# EAGLE design Whastbee-display3 (EAGLE 7.6.0)
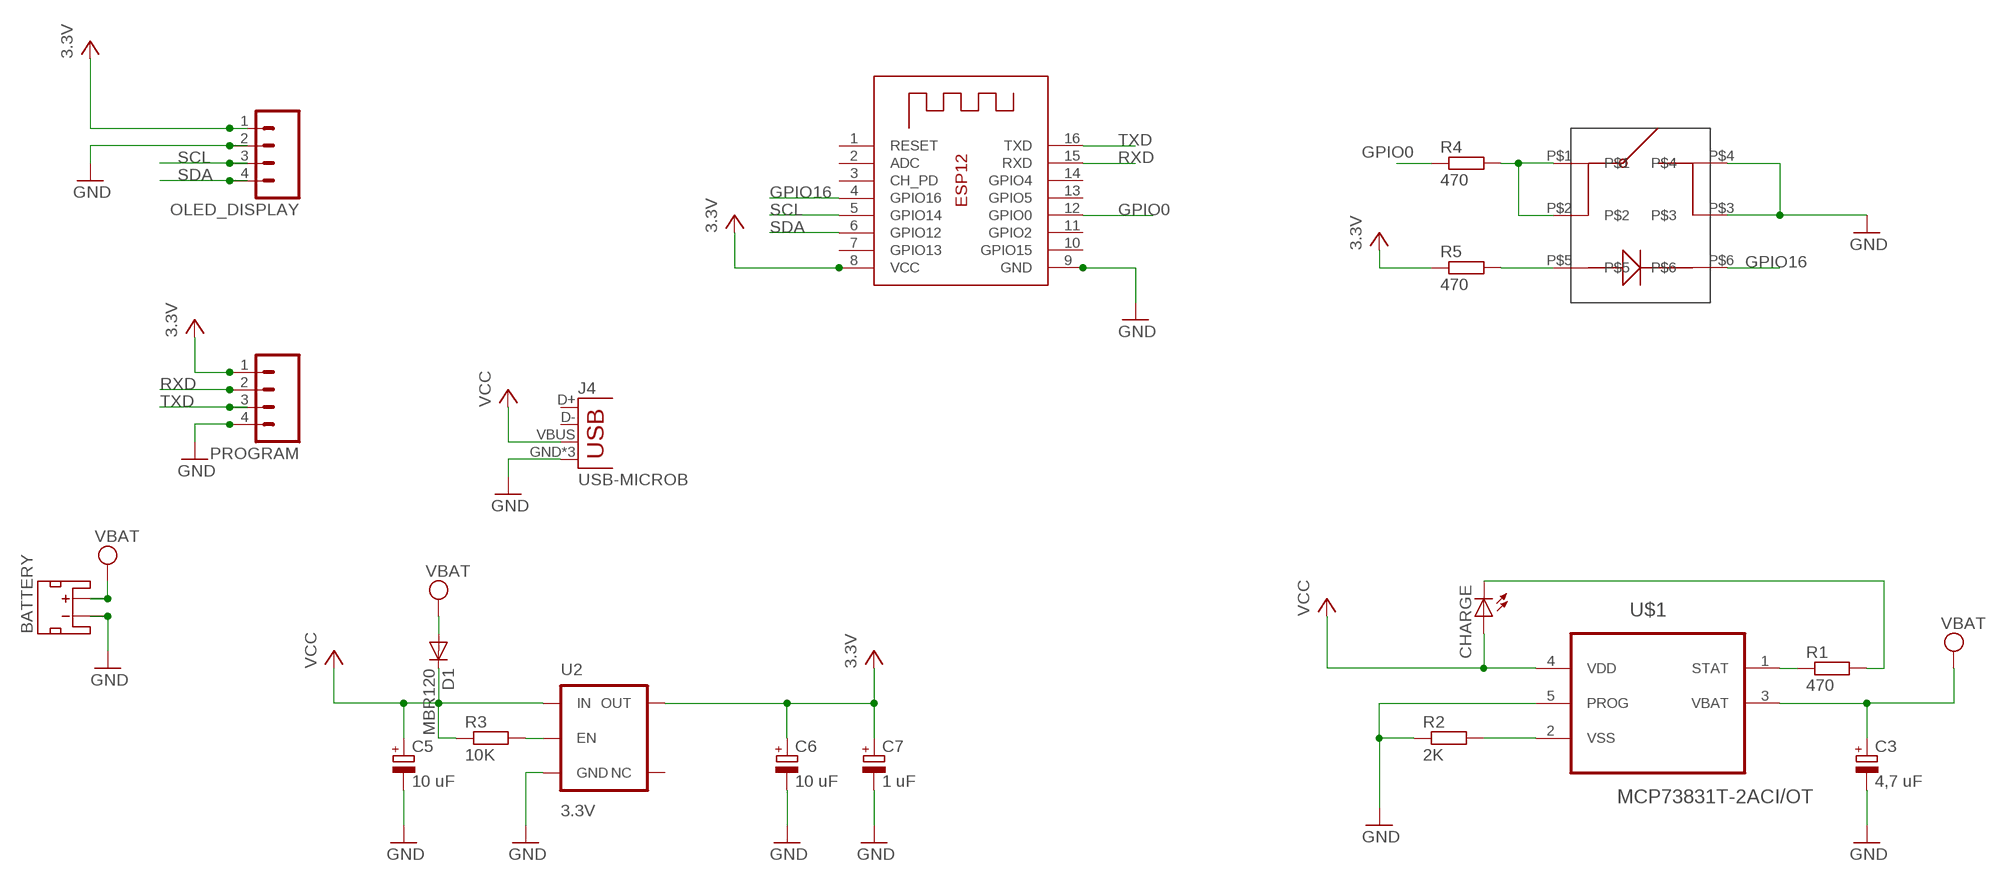
[diagram p0: schematic, sheet 1]

## Parts
BATTERY  JST_2MM_MALE  [JST-2-SMD]
C3  4,7 uF  CPOL-EUT/3528-12R  [T/3528-12R]
C5  10 uF  CPOL-EUT/3528-12R  [T/3528-12R]
C6  10 uF  CPOL-EUT/3528-12R  [T/3528-12R]
C7  1 uF  CPOL-EUT/3528-12R  [T/3528-12R]
CHARGE  LEDCHIPLED_0805  [CHIPLED_0805]
D1  MBR120  CGRM4001-G  [SOD-123_MINI-SMA]
ESP8266-12  ESP-12  [ESP-12]
J4  USB-MICROB  [USB-MICROB]
OLED_DISPLAY  M04PTH  [1X04]
PROGRAM  M04LOCK  [1X04_LOCK]
R1  470  R  [R0805]
R2  2K  R  [R0805]
R3  10K  R  [R0805]
R4  470  R  [R0805]
R5  470  R  [R0805]
U2  3.3V  V_REG_AP2112K-3.3V  [SOT23-5]
U$1  MCP73831T-2ACI/OT  [SOT95P280X145-5N]
U$2  SWITCH-LED_AMIDATA  [LED]

## Nets
3.3V: C6.+ C7.+ ESP8266-12.8(VCC) OLED_DISPLAY.1 PROGRAM.1 R5.1 U2.5(OUT)
GND: BATTERY.1(-) C3.- C5.- C6.- C7.- ESP8266-12.9(GND) J4.GND J4.MT1(GND) J4.MT2(GND) OLED_DISPLAY.2 PROGRAM.4 R2.1 U2.2(GND) U$1.5(PROG) U$2.P$3 U$2.P$4
GPIO0: ESP8266-12.12(GPIO0) R4.1
GPIO16: ESP8266-12.4(GPIO16) U$2.P$6
N$2: R5.2 U$2.P$5
N$4: R2.2 U$1.2(VSS)
N$7: R1.1 U$1.1(STAT)
N$8: CHARGE.C R1.2
N$9: R3.2 U2.3(EN)
PS1: R4.2 U$2.P$1 U$2.P$2
RXD: ESP8266-12.15(RXD) PROGRAM.2
SCL: ESP8266-12.5(GPIO14) OLED_DISPLAY.3
SDA: ESP8266-12.6(GPIO12) OLED_DISPLAY.4
TXD: ESP8266-12.16(TXD) PROGRAM.3
VBAT: BATTERY.2(+) C3.+ D1.A U$1.3(VBAT)
VCC: C5.+ CHARGE.A D1.C J4.VBUS R3.1 U2.1(IN) U$1.4(VDD)
Unconnected: BATTERY.NC1(PAD1) BATTERY.NC2(PAD2) ESP8266-12.1(RESET) ESP8266-12.2(ADC) ESP8266-12.3(CH_PD) ESP8266-12.7(GPIO13) ESP8266-12.10(GPIO15) ESP8266-12.11(GPIO2) ESP8266-12.13(GPIO5) ESP8266-12.14(GPIO4) J4.D+ J4.D- U2.4(NC)

## Library data of the parts
BATTERY = SparkFun-Connectors:JST_2MM_MALE: Mates to single-cell LiPo batteries. CONN-11443 Now with smashable polarity marks!; BTM_NEG: -; BTM_POS: +; PROD_ID: CONN-11443; TOP_NEG: -; TOP_POS: +
C3 C5-C7 = resistor:CPOL-EU: POLARIZED CAPACITOR, European symbol
CHARGE = adafruit:LED: LED OSRAM: - CHIPLED LG R971, LG N971, LY N971, LG Q971, LY Q971, LO R971, LY R971 LH N974, LH R974 LS Q976, LO Q976, LY Q976 LO Q996 - Hyper CHIPLED LW Q18S LB Q993, LB Q99A, LB R99A - SideLED LS A670, LO A670, LY A670, LG A670, LP A670 LB A673, LV A673, LT A673, LW A673 LH A674 LY A675 LS A676, LA A676, LO A676, LY A676, LW A676 LS A679, LY A679, LG A679 - Hyper Micro SIDELED® LS Y876, LA Y876, LO Y876, LY Y876 LT Y87S - SmartLED LW L88C, LW L88S LB L89C, LB L89S, LG L890 LS L89K, LO L89K, LY L89K LS L896, LA L896, LO L896, LY L896 - TOPLED LS T670, LO T670, LY T670, LG T670, LP T670 LSG T670, LSP T670, LSY T670, LOP T670, LYG T670 LG T671, LOG T671, LSG T671 LB T673, LV T673, LT T673, LW T673 LH T674 LS T676, LA T676, LO T676, LY T676, LB T676, LH T676, LSB T676, LW T676 LB T67C, LV T67C, LT T67C, LS T67K, LO T67K, LY T67K, LW E67C LS E67B, LA E67B, LO E67B, LY E67B, LB E67C, LV E67C, LT E67C LW T67C LS T679, LY T679, LG T679 LS T770, LO T770, LY T770, LG T770, LP T770 LB T773, LV T773, LT T773, LW T773 LH T774 LS E675, LA E675, LY E675, LS T675 LS T776, LA T776, LO T776, LY T776, LB T776 LHGB T686 LT T68C, LB T68C - Hyper Mini TOPLED® LB M676 - Mini TOPLED Santana® LG M470 LS M47K, LO M47K, LY M47K Source: http://www.osram.convergy.de/
D1 = diode:CGRM400*-G: Molded plasitc,JEDEC SOD-123/Mini SMA Source: Comchip CGRM4001-G.pdf
ESP8266-12 = adafruit:ESP-12
J4 = SparkFun-Connectors:USB: USB Connectors USB-B-PTH is fully proven SKU : PRT-00139/CONN-08278 USB-miniB is fully proven SKU : PRT-00587 USB-A-PCB is untested. USB-A-H is throughly reviewed, but untested. Spark Fun Electronics SKU : PRT-00437 USB-B-SMT is throughly reviewed, but untested. Needs silkscreen touching up. USB-A-S has not been used/tested USB-MB-H has not been used/tested USB-MICROB has been used. CONN-09505; PROD_ID: CONN-09505
OLED_DISPLAY PROGRAM = SparkFun-Connectors:M04: Header 4 Standard 4-pin 0.1" header. Use with straight break away headers (SKU : PRT-00116), right angle break away headers (PRT-00553), swiss pins (PRT-00743), machine pins (PRT-00117), and female headers (PRT-00115). Molex polarized connector foot print use with SKU : PRT-08231 with associated crimp pins and housings. 1MM SMD Version SKU: PRT-10208; PROD_ID: CONN-09696
R1-R5 = eagle-ltspice:R: RESISTOR, European symbol; SPICEMODEL: NONE; SPICEPREFIX: R
U2 = SparkFun-PowerIC:V_REG_AP2112: AP2112 - 600mA CMOS LDO Regulator w/ Enable The AP2112 is CMOS process low dropout linear regulator with enable function, the regulator delivers a guaranteed 600mA (min.) continuous load current. Features Output Voltage Accuracy: ±1.5% Output Current: 600mA (Min.) Foldback Short Current Protection: 50mA Enable Function to Turn ON/OFF VOUT Low Dropout Voltage (3.3V): 250mV (Typ.) @IOUT=600mA Excellent Load Regulation: 0.2%/A (Typ.) Excellent Line Regulation: 0.02%/V (Typ.) Low Quiescent Current: 55μA (Typ.) Low Standby Current: 0.01μA (Typ.) Low Output Noise: 50μVRMS PSRR: 100Hz -65dB, 1kHz -65dB OTSD Protection Stable with 1.0μF Flexible Cap: Ceramic, Tantalum and Aluminum Electrolytic Operation Temperature Range: -40°C to 85°C ESD: MM 400V, HBM 4000V; PROD_ID: VREG-12457
U$1 = MCP73831T-2ACI_OT:MCP73831T-2ACI/OT: Charge Management Controller
U$2 = bmotes:SWITCH-LED_AMIDATA

## Board
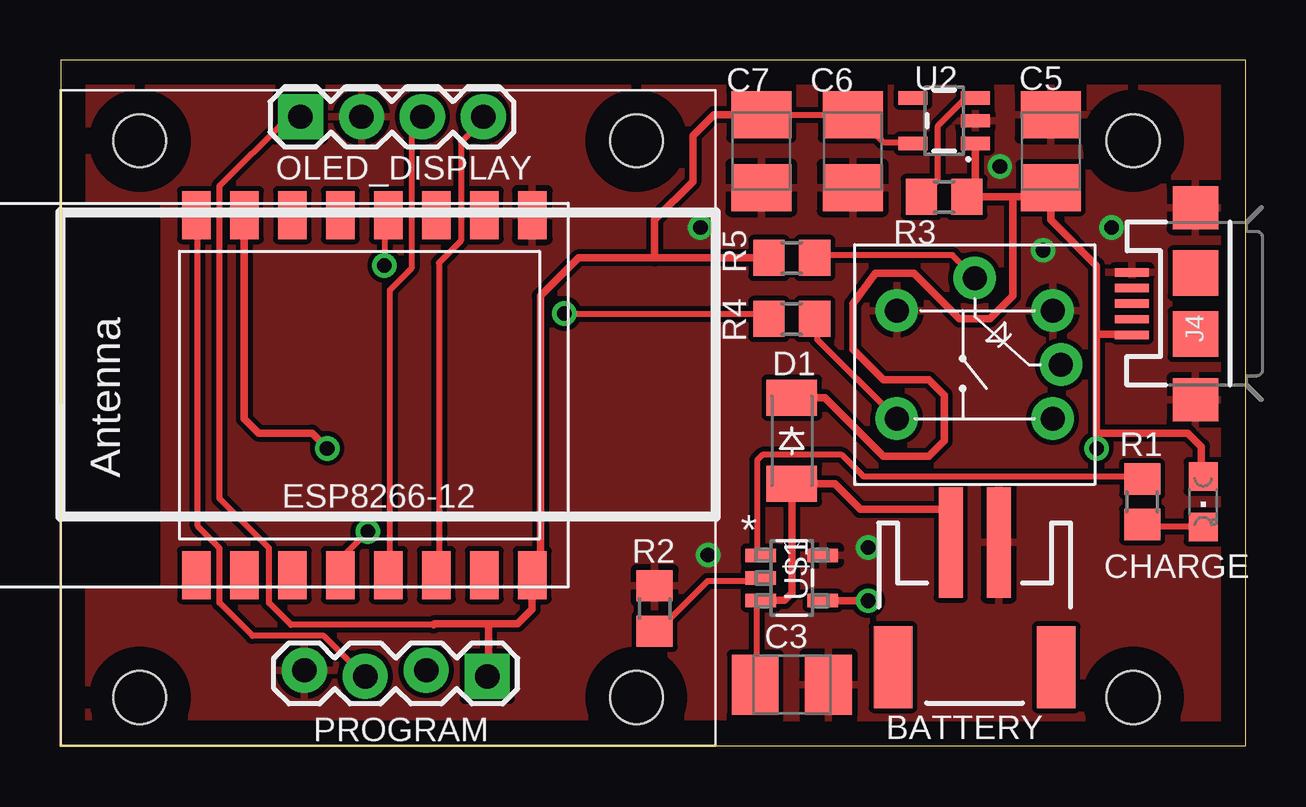
[diagram p1: board, top side]
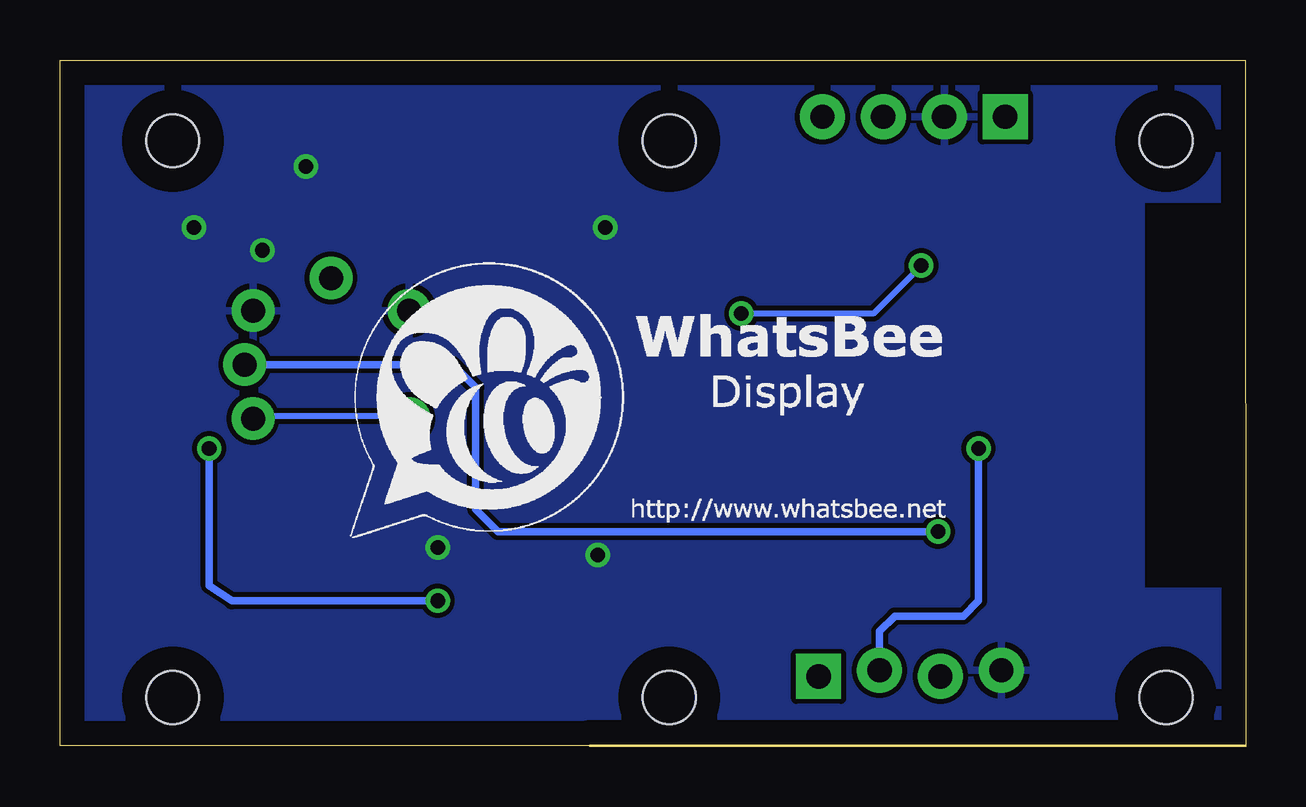
[diagram p2: board, bottom side, seen from below]

Size 49.43 x 28.62 mm. Coordinates in mm from the lower left corner, seen from the top.
Outline: 0,0 0.03,28.62 49.43,28.62 49.43,0.06 27.33,0.06 0.03,0.06
Copper layers (1*16): Top 0.035mm / dielectric 1.5mm / Bottom 0.035mm
Design rules "default": minimum track width 10mil, minimum drill 24mil, track to track 8mil, track to pad 8mil, pad to pad 8mil, via to via 8mil, smd to smd 8mil, copper to edge 40mil, drill to drill 8mil, minimum pad ring 10mil, minimum via ring 8mil, stop-mask expansion 4mil, vias tented up to drill 0mil, thermal gap 10mil
Holes 2.2 mm at 3.33,2.06 24.03,2.06 3.33,25.26 24.03,25.26 44.73,25.26 44.73,2.06

### Footprints (pad centres in the part's own frame; a part is rotated, then mirrored left to right if it is on the bottom)
JST-2-SMD = smd 1 x 4.6: 1 -1,-3.7; 2 1,-3.7 | smd 1.6 x 3.4: NC1 -3.4,1.5; NC2 3.4,1.5
T/3528-12R = smd 1.95 x 2.5: + 1.525,0; - -1.525,0
CHIPLED_0805 = smd 1.2 x 1.2: A 0,-1.05; C 0,1.05
SOD-123_MINI-SMA = smd 1.5 x 2.1: A 1.8,0; C -1.8,0
ESP-12 = smd 2 x 1.2: 1 -7.5,4.5; 2 -7.5,2.5; 3 -7.5,0.5; 4 -7.5,-1.5; 5 -7.5,-3.5; 6 -7.5,-5.5; 7 -7.5,-7.5; 8 -7.5,-9.5; 9 7.5,-9.5; 10 7.5,-7.5; 11 7.5,-5.5; 12 7.5,-3.5; 13 7.5,-1.5; 14 7.5,0.5; 15 7.5,2.5; 16 7.5,4.5
USB-MICROB = smd 0.35 x 1.4: D+ 0,2.65; D- -0.65,2.65; GND 1.3,2.65; ID 0.65,2.65; VBUS -1.3,2.65 | smd 1.8 x 1.9: MT1 -4,0; MT2 4,0 | smd 1.9 x 1.9: P$1 -1.27,0; P$2 1.27,0
1X04 = drill 1.016 pad 1.88 square: 1 0,0 | drill 1.016 pad 1.88: 2 2.54,0; 3 5.08,0; 4 7.62,0
1X04_LOCK = drill 1.016 pad 1.88 square: 1 0,0.127 | drill 1.016 pad 1.88: 2 2.54,-0.127; 3 5.08,0.127; 4 7.62,-0.127
R0805 = smd 1.3 x 1.5: 1 -0.95,0; 2 0.95,0
SOT23-5 = smd 0.55 x 1.2: 1 -0.95,-1.3; 2 0,-1.3; 3 0.95,-1.3; 4 0.95,1.3; 5 -0.95,1.3
SOT95P280X145-5N = smd 1.27 x 0.559: 1 -1.295,0.94; 2 -1.295,0; 3 -1.295,-0.94; 4 1.295,-0.94; 5 1.295,0.94
LED = drill 1 pad 1.778: P$1 -3.25,-2.25; P$2 3.25,-2.25; P$3 3.25,2.25; P$4 -3.25,2.25; P$5 0,3.6; P$6 3.6,0

### Placement (x,y rotation side)
BATTERY  38.13,4.82 180 top
C3  30.51,2.6 180 top
C5  41.3,24.82 270 top
C6  33.05,24.82 90 top
C7  29.24,24.82 90 top
CHARGE  47.65,10.22 180 top
D1  30.51,12.76 270 top
ESP8266-12  10.19,14.66 90 top
J4  47.33,18.47 90 top
OLED_DISPLAY  10.03,26.26 0 top
PROGRAM  17.81,3.07 180 top
R1  45.11,10.22 270 top
R2  24.79,5.77 270 top
R3  36.86,22.92 180 top
R4  30.51,17.84 0 top
R5  30.51,20.38 0 top
U2  36.86,26.09 90 top
U$1  30.51,7.04 0 top
U$2  38.13,15.93 0 top

### Tracks (layer width: path | path; a pad name or v marks a point on that pad's centre or on a via)
3.3V
  Top 0.254: U2.5 35.46,25.2 34.32,25.2 33.17,26.34 C6.+ 32.94,26.34 29.29,26.34 C7.+ 29.06,26.34 | 29.51,20.4 R5.1 29.51,20.17 | 19.69,7.14 ESP8266-12.8 | 17.86,3.03 PROGRAM.1 17.63,3.03 | 15.57,5.08 9.63,5.08 8.71,6 8.71,8.29 6.65,10.34 6.65,23.37 9.4,26.12 9.86,26.12 OLED_DISPLAY.1
  Top 0.305: R5.1 24.79,20.38 | 24.79,20.38 21.62,20.38 20.03,18.79 20.03,7.5 ESP8266-12.8 | 19.69,7.14 19.69,5.75 19.08,5.14 17.81,5.14 | 17.81,5.14 15.62,5.14 15.57,5.08 | 17.86,3.03 17.86,5.08 17.81,5.14 | 24.79,20.38 24.79,21.96 26.38,23.55 26.38,25.46 27.27,26.34 29.06,26.34
  Bottom 0.254: 17.86,3.03 PROGRAM.1
GND  (via drill 0.61)
  Top 0.254: 29.29,23.37 C7.- | 32.94,23.37 C6.-
  Top 0.305: U2.2 38.44,26.09 | 39.08,8.57 BATTERY.1
  Bottom 0.254: 34.77,18.11 U$2.P$4
  other vias: 40.98,20.69 43.84,21.65 26.7,21.65 33.68,8.31 27.01,7.99 39.18,24.19
  pour Top: 0.34,28.63 49.56,28.63 49.56,0.06 0.34,0.06
  pour Bottom: 0.03,28.63 49.24,28.63 49.24,0.06 0.03,0.06
GPIO0  (via drill 0.61)
  Top 0.254: v21.03,18.06 29.53,18.06 R4.1 | v13.53,20.06 13.53,22.06 ESP8266-12.12
  Bottom 0.254: v21.03,18.06 15.53,18.06 v13.53,20.06
GPIO16  (via drill 0.61)
  Top 0.254: v12.83,8.97 11.91,8.06 11.91,7.37 ESP8266-12.4
  Bottom 0.305: v12.83,8.97 31.17,8.97 32.09,9.9 32.09,14.98 33.05,15.93 U$2.P$6
N$2
  Top 0.254: R5.2 31.25,20.49 37.2,20.49 37.97,19.72 U$2.P$5
N$4
  Top 0.254: U$1.2 29.06,6.91 27,6.91 24.94,4.86 R2.2
N$7
  Top 0.254: U$1.1 29.06,8.06 29.06,11.94 29.29,12.17 32.59,12.17 33.5,11.26 45.06,11.26 R1.1
N$8
  Top 0.254: CHARGE.C 47.57,9.2 45.29,9.2 R1.2
N$9
  Top 0.254: U2.3 37.97,27.03 37.74,27.03 36.6,25.89 36.6,23.6 R3.2
PS1
  Top 0.254: R4.2 31.57,17.66 31.57,16.97 34.77,13.77 U$2.P$1
  Bottom 0.254: U$2.P$2 41.17,13.77 35,13.77 U$2.P$1
RXD  (via drill 0.61)
  Top 0.305: ESP8266-12.15 7.69,13.67 8.28,13.07 10.5,13.07 v11.14,12.44
  Bottom 0.305: v11.14,12.44 11.14,6.09 11.77,5.45 14.63,5.45 15.27,4.82 PROGRAM.2
SCL
  Top 0.254: ESP8266-12.5 13.74,7.37 13.74,19.03 14.66,19.94 14.66,25.89 14.88,26.12 OLED_DISPLAY.3
SDA
  Top 0.254: ESP8266-12.6 15.8,7.37 15.8,20.17 16.71,21.09 16.71,25.2 17.63,26.12 OLED_DISPLAY.4
TXD
  Top 0.254: ESP8266-12.16 5.74,22 5.74,9.2 6.65,8.29 6.65,6 8.03,4.63 11,4.63 12.6,3.03 PROGRAM.3
VBAT
  Top 0.254: U$1.3 29.06,6 29.06,2.8 C3.+
  Top 0.305: U$1.3 30.2,6.1 30.51,6.41 D1.A 32.31,10.96 33.36,9.9 37.17,9.9 37.17,8.57 BATTERY.2
VCC  (via drill 0.61)
  Top 0.254: 47.57,11.49 CHARGE.A
  Top 0.305: J4.VBUS 44.65,17.2 43.21,17.2 | U2.1 38.16,23.27 R3.1 39.71,22.92 | 39.71,22.92 40.92,22.92 C5.+ 41.3,21.96 43.21,20.06 43.21,17.2 | D1.C 31.88,14.56 34.32,12.12 36.22,12.12 36.86,12.76 36.86,14.66 36.22,15.3 34.32,15.3 33.05,16.57 33.05,18.47 34,19.74 35.59,19.74 37.49,17.84 38.76,17.84 39.71,18.79 39.71,22.92 | U$1.4 31.79,6.1 31.78,6.09 v33.68,6.09 | 47.57,11.49 47.57,12.51 47.02,13.07 43.21,13.07 | 43.21,17.2 43.21,13.07 | 43.21,13.07 v43.21,12.44
  Bottom 0.305: v33.68,6.09 42.25,6.09 43.21,6.72 v43.21,12.44